# EAGLE design Adafruit PCF8523 RTC HVSON (EAGLE 9.6.2)
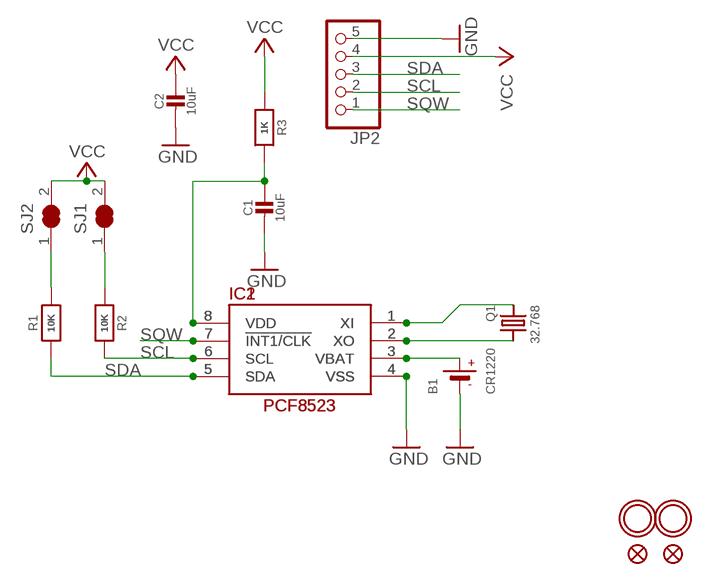
[diagram p0: schematic, sheet 1]

## Parts
B1  CR1220  BATTERYCR1220_SMT  [CR1220]
C1  10uF  CAP_CERAMIC0805-NOOUTLINE  [0805-NO]
C2  10uF  CAP_CERAMIC0805-NOOUTLINE  [0805-NO]
FID1  FIDUCIAL_1MM  [FIDUCIAL_1MM]
FID2  FIDUCIAL_1MM  [FIDUCIAL_1MM]
IC1  RTC_PCF8523/T  [SOIC8_150MIL]
IC2  RTC_PCF8523/TK  [HVSON8_4X4]
JP2  HEADER-1X576MIL  [1X05_ROUND_76]
Q1  32.768  CRYSTAL_3215  [XTAL3215]
R1  10K  RESISTOR0805_NOOUTLINE  [0805-NO]
R2  10K  RESISTOR0805_NOOUTLINE  [0805-NO]
R3  1K  RESISTOR0805_NOOUTLINE  [0805-NO]
SJ1  SOLDERJUMPER_CLOSED  [SOLDERJUMPER_CLOSEDWIRE]
SJ2  SOLDERJUMPER_CLOSED  [SOLDERJUMPER_CLOSEDWIRE]
U$1  MOUNTINGHOLE2.0  [MOUNTINGHOLE_2.0_PLATED]
U$4  MOUNTINGHOLE2.0  [MOUNTINGHOLE_2.0_PLATED]

## Nets
GND: B1.- C1.2 C2.2 IC1.4(VSS) IC2.4(VSS) JP2.5
N$1: R2.1 SJ1.1
N$2: R1.2 SJ2.1
N$3: C1.1 IC1.8(VDD) IC2.8(VDD) R3.2
N$14: IC1.1(XI) IC2.1(XI) Q1.P$1
N$15: IC1.2(XO) IC2.2(XO) Q1.P$2
SCL: IC1.6(SCL) IC2.6(SCL) JP2.2 R2.2
SDA: IC1.5(SDA) IC2.5(SDA) JP2.3 R1.1
SQW: IC1.7(!INT1/CLK) IC2.7(!INT1/CLK) JP2.1
VBAT: B1.+$1(+) B1.+$2(+) IC1.3(VBAT) IC2.3(VBAT)
VCC: C2.1 JP2.4 R3.1 SJ1.2 SJ2.2

## Library data of the parts
B1 = microbuilder:BATTERY: CR1220 SMT - Digikey: 3001K-ND CD2032 BAT-HLD-001 - Digikey: BAT-HLD-001-ND
C1 C2 = microbuilder:CAP_CERAMIC: Ceramic Capacitors For new designs, use the packages preceded by an '_' character since they are more reliable: The following footprints should be used on most boards: _0402 - Standard footprint for regular board layouts _0603 - Standard footprint for regular board layouts _0805 - Standard footprint for regular board layouts _1206 - Standard footprint for regular board layouts For extremely tight-pitch boards where space is at a premium, the following 'micro-pitch' footprints can be used (smaller pads, no silkscreen outline, etc.): _0402MP - Micro-pitch footprint for very dense/compact boards _0603MP - Micro-pitch footprint for very dense/compact boards _0805MP - Micro-pitch footprint for very dense/compact boards _1206MP - Micro-pitch footprint for very dense/compact boards
FID1 FID2 = microbuilder:FIDUCIAL: Fiducial Alignment Points Various fiducial points for machine vision alignment.; BOM: EXCLUDE
IC1 IC2 = microbuilder:RTC_PCF8523
JP2 = microbuilder:HEADER-1X5: PIN HEADER
Q1 = microbuilder:CRYSTAL: Crystals HC49UP - Surface Mount Crystal 4.0MHz 18pF +/-30ppm Surface Mount Crystal [Digikey: 535-9857-1-ND] 12.0 MHz Surface Mount Crystal [Digikey: 535-9869-6-ND] 25.0 MHz Surface Mount Crystal [Digikey: 535-9078-1-ND] 2.5 x 2.0mm - MEMs SMT Crystal 16.0 MHz 10pF 20ppm 2.5 x 2.0mm Crystal [Digikey -40-85°C: 535-10923-1-ND] 3.2 x 2.5mm - MEMs SMT Crystal 12.0 MHz 8pF 15ppm 3.2 x 2.5mm Crystal [Digikey: -10-70°C: 644-1047-1-ND -40-125°C: 644-1128-1-ND] 40~85°C cheaper: 644-1173-6-ND 16.0 MHz 8pF 15ppm 3.2 x 2.5mm Crystal [Digikey: -10-70°C: 644-1049-1-ND -40-125°C: 644-1129-2-ND]-40~85°C cheaper: 644-1175-6-ND 16.0 MHz 10pF 10ppm 3.2 x 2.5mm Crystal [Digikey: 644-1100-1-ND] 27.12 MHz 18pF 30ppm 3.2 x 2.5mm Crystal [Digikey: 887-1424-1-ND] 27.12MHz 10pF 10ppm 3.2 x 2.5mm Crystal [Digikey: 887-1329-1-ND] 4.9 x 1.8mm - MEMs SMT Crystal 32.768 KHz 12.5pF 20ppm 4.9 x 1.8mm Crystal [Digikey: SE2415CT-ND] 8.0 x 3.8mm - Surface Mount Crystal 32.768kHz 12.5pF 20ppm -40°C-85°C [Digikey: 535-9166-2-ND] Cylinder 32.768KHz Cylinder Crystal (2x6mm body) [Ex. Digikey: 300-8341-2-ND]
R1-R3 = microbuilder:RESISTOR: Resistors For new designs, use the packages preceded by an '_' character since they are more reliable: The following footprints should be used on most boards: _0402 - Standard footprint for regular board layouts _0603 - Standard footprint for regular board layouts _0805 - Standard footprint for regular board layouts _1206 - Standard footprint for regular board layouts For extremely tight-pitch boards where space is at a premium, the following 'micro-pitch' footprints can be used (smaller pads, no silkscreen outline, etc.): _0402MP - Micro-pitch footprint for very dense/compact boards _0603MP - Micro-pitch footprint for very dense/compact boards _0805MP - Micro-pitch footprint for very dense/compact boards _1206MP - Micro-pitch footprint for very dense/compact boards
SJ1 SJ2 = microbuilder:SOLDERJUMPER_CLOSED: Solder Jumper - Closed These solder jumpers are closed by default CLOSEDWIRE - 10 mil trace between pads that can be cut and resoldered later CLOSEDPERM - 63 mil trace between pads for a permanent connection (used to 'bridge' two signals, a shameless hack for Eagle). Can double as a test point as well (no cream layer)
U$1 U$4 = microbuilder:MOUNTINGHOLE: Mounting Hole For #2 screws (0.086"/2.18mm width, 0.094"/2.4mm hole) use 2.5mm; BOM: EXCLUDE

## Board
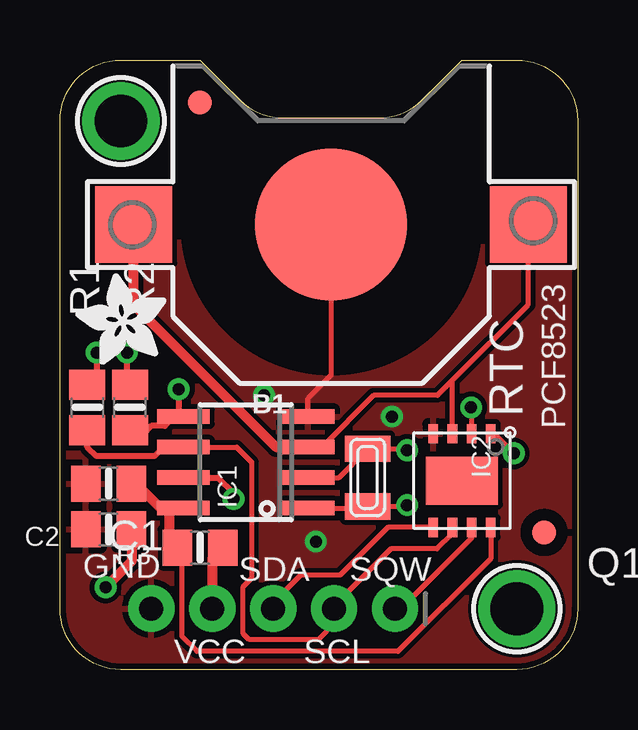
[diagram p1: board, top side]
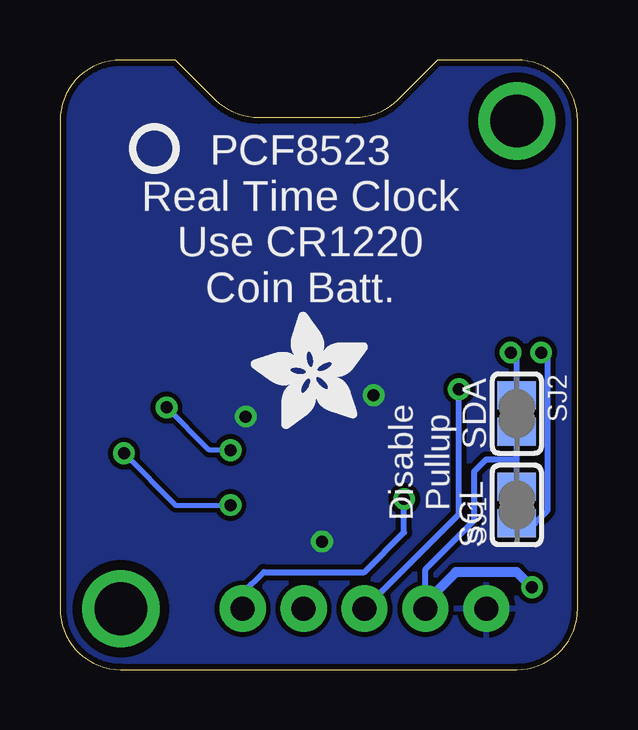
[diagram p2: board, bottom side, seen from below]

Size 21.59 x 25.4 mm. Coordinates in mm from the lower left corner, seen from the top.
Outline: 16.76,25.4 19.05,25.4 arc-90 21.59,22.86 21.59,2.54 arc-90 19.05,0 2.54,0 arc-90 0,2.54 0,22.86 arc-90 2.54,25.4 5.84,25.4 7.51,23.73 arc45 9.31,22.99 13.3,22.99 arc45 15.1,23.73 16.76,25.4
Copper layers (1*16): Top 0.035mm / dielectric 1.5mm / Bottom 0.035mm
Design rules "adafruit *": minimum track width 8mil, minimum drill 15.5mil, track to track 8mil, track to pad 8mil, pad to pad 8mil, via to via 8mil, smd to smd 8mil, copper to edge 10mil, drill to drill 8mil, minimum pad ring 10mil, minimum via ring 8mil, stop-mask expansion 2mil, vias tented up to drill 20mil, thermal gap 10mil

### Footprints (pad centres in the part's own frame; a part is rotated, then mirrored left to right if it is on the bottom)
CR1220 = smd 3.2 x 3.2: +$1 -8.225,0; +$2 8.225,0 | smd 6.35 x 6.35: - 0,0
0805-NO = smd 1.24 x 1.5: 1 -0.95,0; 2 0.95,0
FIDUCIAL_1MM = smd 1 x 1: 1 0,0
SOIC8_150MIL = smd 0.6 x 2.2: 1 -1.905,-2.6; 2 -0.635,-2.6; 3 0.635,-2.6; 4 1.905,-2.6; 5 1.905,2.6; 6 0.635,2.6; 7 -0.635,2.6; 8 -1.905,2.6
HVSON8_4X4 = smd 0.8 x 0.4: 1 -1.95,1.2; 2 -1.95,0.4; 3 -1.95,-0.4; 4 -1.95,-1.2; 5 1.95,-1.2; 6 1.95,-0.4; 7 1.95,0.4; 8 1.95,1.2 | smd 2 x 3: PAD 0,0
1X05_ROUND_76 = drill 1 pad 1.93: 1 -5.08,0; 2 -2.54,0; 3 0,0; 4 2.54,0; 5 5.08,0
XTAL3215 = smd 1.1 x 1.9: P$1 1.2,0; P$2 -1.2,0
SOLDERJUMPER_CLOSEDWIRE = smd 1.168 x 1.6: 1 -0.762,0; 2 0.762,0 | smd 0.635 x 0.203: WIRE 0,0
MOUNTINGHOLE_2.0_PLATED = drill 2.2 pad 3: P$1 0,0

### Placement (x,y rotation side)
B1  11.3,18.54 0 top
C1  2.03,7.75 180 top
C2  2.03,5.84 180 top
FID1  5.84,23.62 90 top
FID2  20.19,5.71 90 top
IC1  7.75,8.64 90 top
IC2  16.76,7.87 270 top
JP2  8.89,2.54 180 top
Q1  12.83,8 270 top
R1  2.92,10.92 90 top
R2  1.14,10.92 270 top
R3  5.84,5.08 180 top
SJ1  2.54,6.86 90 bottom
SJ2  2.54,10.67 270 bottom
U$1  2.54,22.86 90 top
U$2  [ADAFRUIT_3.5MM]  4.45,12.7 90 top
U$3  [PCBFEAT-REV-040]  17.65,21.72 180 bottom
U$4  19.05,2.54 90 top
U$5  [ADAFRUIT_5MM]  8.76,10.03 90 bottom

### Tracks (layer width: path | path; a pad name or v marks a point on that pad's centre or on a via)
GND  (via drill 0.5)
  Top 0.203: B1.- 11.3,12.26 10.35,11.3 IC1.4
  other vias: 10.67,5.33 8.51,11.43 13.84,10.54
  pour Top: 0,0 21.59,0 21.59,25.4 0,25.4
  pour Bottom: 0,0 21.59,0 21.59,25.4 0,25.4
N$1  (via drill 0.5)
  Top 0.254: v1.52,13.21 1.52,12.25 R2.1
  Bottom 0.254: v1.52,13.21 1.27,12.95 1.27,6.6 1.78,6.1 SJ1.1
N$2  (via drill 0.5)
  Top 0.254: R1.2 2.79,12 v2.79,13.21
  Bottom 0.254: SJ2.1 2.54,12.95 v2.79,13.21
N$3
  Top 0.203: IC2.8 17.96,4.63 14.1,0.76 5.71,0.76 5.08,1.4 5.08,4.89 R3.2
  Top 0.406: C1.1 3.17,7.75 4.19,6.73 4.57,6.73 | 4.57,6.73 IC1.8 | R3.2 4.57,5.4 4.57,6.73
N$14  (via drill 0.5)
  Top 0.203: IC1.1 12.76,6.73 Q1.P$1 14.42,6.8 v14.48,6.86 | IC2.1 18.11,9.82 v18.92,9.01
  Bottom 0.203: v18.92,9.01 16.77,6.86 v14.48,6.86
N$15  (via drill 0.5)
  Top 0.203: IC1.2 11.63,8 Q1.P$2 14.42,9.2 v14.48,9.14 | v17.14,10.92 17.16,10.92 IC2.2
  Bottom 0.203: v14.48,9.14 15.37,9.14 v17.14,10.92
SCL
  Top 0.203: IC2.6 16.36,5.67 15.73,5.04 13.8,5.04 11.43,2.67 | IC1.6 7.37,9.27 8,8.64 8,3.81 7.62,3.43 7.62,1.52 7.87,1.27 10.79,1.27 11.43,1.91 JP2.2
  Top 0.254: JP2.2 11.43,2.67 | IC1.6 4.32,9.27 3.94,8.89 1.52,8.89 1.14,9.27 R2.2
SDA  (via drill 0.5)
  Top 0.203: IC2.5 13.67,5.92 11.68,3.94 10.03,3.94 8.89,2.79 JP2.3
  Top 0.254: v4.95,11.68 4.95,10.73 | 4.95,10.73 IC1.5 | 4.95,10.73 4.38,10.16 3.81,10.16 3.62,9.97 R1.1
  Bottom 0.254: JP2.3 4.95,6.48 v4.95,11.68
SQW  (via drill 0.5)
  Top 0.203: IC2.7 17.16,5.48 14.22,2.54 JP2.1
  Top 0.254: v7.24,7.11 7.24,7.37 6.6,8 IC1.7
  Bottom 0.254: JP2.1 13.97,3.17 13.08,4.06 8.89,4.06 7.24,5.71 v7.24,7.11
VBAT
  Top 0.203: IC2.3 16.36,12.05 | IC1.3 10.92,9.27 13.08,11.43 15.75,11.43 16.36,12.05 | 16.36,12.05 19.53,15.21 B1.+$2
  Top 0.406: B1.+$1 3.08,15.21 9.02,9.27 IC1.3
VCC  (via drill 0.5)
  Top 0.406: R3.1 6.35,4.64 JP2.4 | C2.1 2.98,4.51 v1.91,3.43
  Bottom 0.254: SJ1.2 2.54,8.76 | JP2.4 6.35,4.19 4.32,6.22 4.32,8.26 3.81,8.76 2.54,8.76 | 2.54,8.76 SJ2.2
  Bottom 0.406: v1.91,3.43 2.54,4.06 5.08,4.06 6.35,2.79 JP2.4

### Text on the board
tPlace: RTC | PCF8523 | GND | SDA | SQW | VCC | SCL
bPlace: PCF8523 / Real Time Clock / Use CR1220 / Coin Batt. | SDA | Disable / Pullup | SCL